# EAGLE design version10_31 (EAGLE 7.1.0)
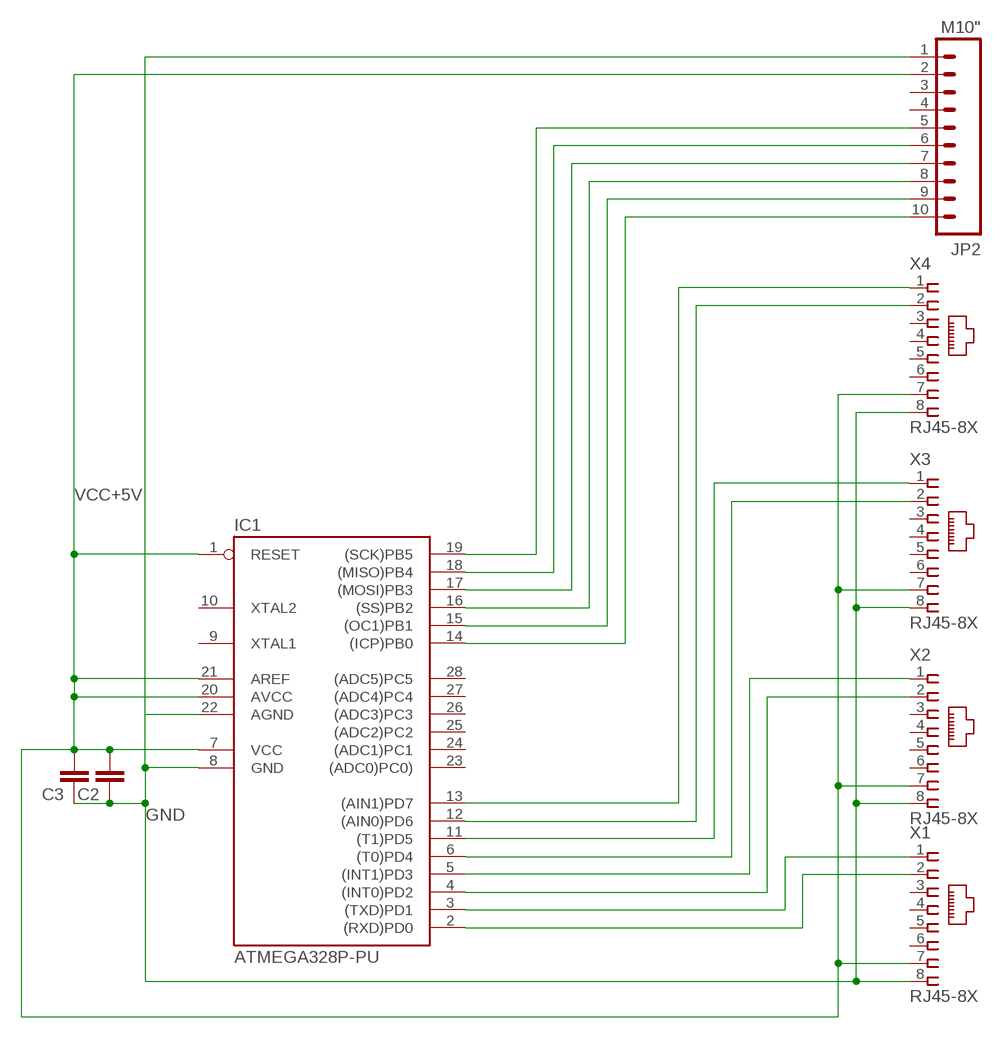
[diagram p0: schematic, sheet 1]

## Parts
C2  CAP1206  [1206]
C3  CAP1206  [1206]
IC1  ATMEGA328P-PU  [DIL28-3]
JP2  M10"  [1X10]
X1  RJ45-8X  [RJ45-NO-SHIELD]
X2  RJ45-8X  [RJ45-NO-SHIELD]
X3  RJ45-8X  [RJ45-NO-SHIELD]
X4  RJ45-8X  [RJ45-NO-SHIELD]

## Nets
GND: C2.1 C3.1 IC1.8(GND) IC1.22(AGND) JP2.1 X1.8 X2.8 X3.8 X4.8
N$1: IC1.19((SCK)PB5) JP2.5
N$2: IC1.18((MISO)PB4) JP2.6
N$3: IC1.15((OC1)PB1) JP2.9
N$4: IC1.17((MOSI)PB3) JP2.7
N$5: IC1.16((SS)PB2) JP2.8
N$6: IC1.14((ICP)PB0) JP2.10
N$7: IC1.2((RXD)PD0) X1.2
N$8: IC1.3((TXD)PD1) X1.1
N$9: IC1.4((INT0)PD2) X2.2
N$10: IC1.5((INT1)PD3) X2.1
N$11: IC1.6((T0)PD4) X3.2
N$12: IC1.11((T1)PD5) X3.1
N$13: IC1.12((AIN0)PD6) X4.2
N$14: IC1.13((AIN1)PD7) X4.1
VCC+5V: C2.2 C3.2 IC1.1(RESET) IC1.7(VCC) IC1.20(AVCC) IC1.21(AREF) JP2.2 X1.7 X2.7 X3.7 X4.7
Unconnected: IC1.9(XTAL1) IC1.10(XTAL2) IC1.23((ADC0)PC0)) IC1.24((ADC1)PC1) IC1.25((ADC2)PC2) IC1.26((ADC3)PC3) IC1.27((ADC4)PC4) IC1.28((ADC5)PC5) JP2.3 JP2.4 X1.3 X1.4 X1.5 X1.6 X2.3 X2.4 X2.5 X2.6 X3.3 X3.4 X3.5 X3.6 X4.3 X4.4 X4.5 X4.6

## Library data of the parts
C2 C3 = SparkFun-Capacitors:CAP: Capacitor Standard 0603 ceramic capacitor, and 0.1" leaded capacitor.
IC1 = SmartPrj:ATMEGA328P-: MICROCONTROLLER 4 Kbytes FLASH 128 bytes SRAM 256 bytes EEPROM UART 6-channel 10 bit ADC
JP2 = SparkFun-Connectors:M10: Header 10 Standard 10-pin 0.1" header. Use with straight break away headers (SKU : PRT-00116), right angle break away headers (PRT-00553), swiss pins (PRT-00743), machine pins (PRT-00117), and female headers (PRT-00115).
X1-X4 = con-tycoelectronics:RJ45: CORCOM Modular RJ Jacks No Shield Source: www.tycoelectronics.com .. ENG_DS_1654001_1099_RJ_L_0507.pdf; MPN: RJ45-8X; OC_FARNELL: unknown; OC_NEWARK: 16R6101

## Board
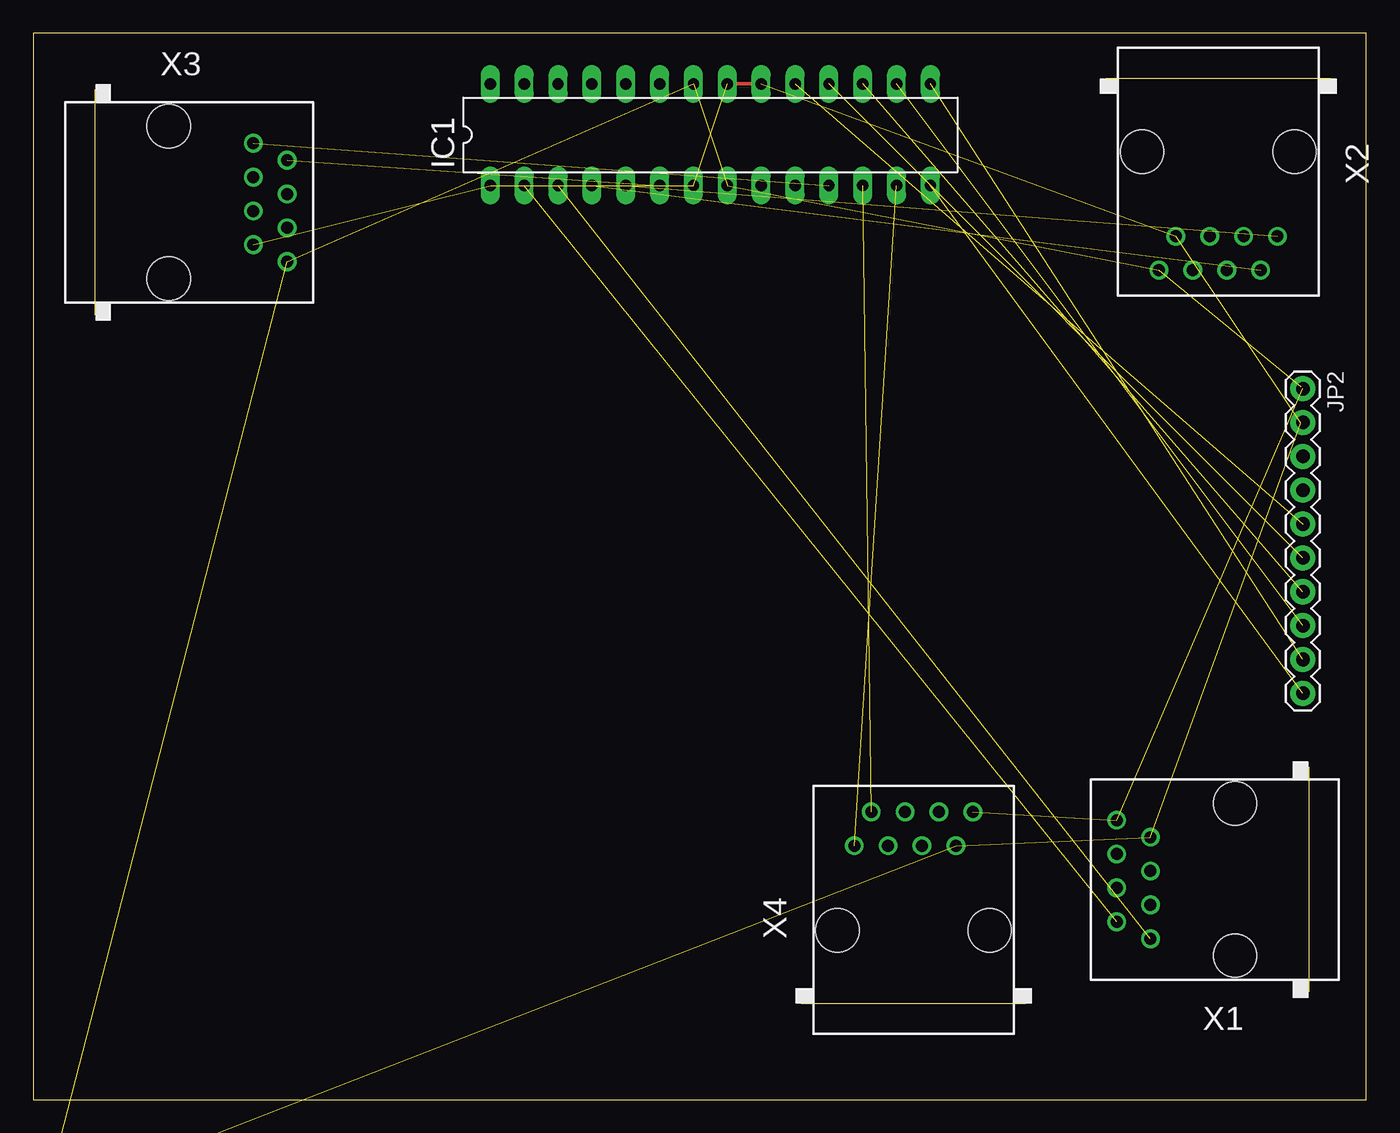
[diagram p1: board, top side]

Size 100 x 80 mm. Coordinates in mm from the lower left corner, seen from the top.
Outline: 0,0 100,0 100,80 0,80 0,0
Copper layers (1*16): Top 0.035mm / dielectric 1.5mm / Bottom 0.035mm
Design rules "default": minimum track width 10mil, minimum drill 24mil, track to track 8mil, track to pad 8mil, pad to pad 8mil, via to via 8mil, smd to smd 8mil, copper to edge 40mil, drill to drill 8mil, minimum pad ring 10mil, minimum via ring 8mil, stop-mask expansion 4mil, vias tented up to drill 0mil, thermal gap 10mil

### Footprints (pad centres in the part's own frame; a part is rotated, then mirrored left to right if it is on the bottom)
1206 = smd 1.6 x 1.8: 1 -1.4,0; 2 1.4,0
DIL28-3 = drill 0.85 pad 1.422 long: 1 -16.51,-3.81; 2 -13.97,-3.81; 3 -11.43,-3.81; 4 -8.89,-3.81; 5 -6.35,-3.81; 6 -3.81,-3.81; 7 -1.27,-3.81; 8 1.27,-3.81; 9 3.81,-3.81; 10 6.35,-3.81; 11 8.89,-3.81; 12 11.43,-3.81; 13 13.97,-3.81; 14 16.51,-3.81; 15 16.51,3.81; 16 13.97,3.81; 17 11.43,3.81; 18 8.89,3.81; 19 6.35,3.81; 20 3.81,3.81; 21 1.27,3.81; 22 -1.27,3.81; 23 -3.81,3.81; 24 -6.35,3.81; 25 -8.89,3.81; 26 -11.43,3.81; 27 -13.97,3.81; 28 -16.51,3.81
1X10 = drill 1.016 pad 1.88: 1 0,0; 2 2.54,0; 3 5.08,0; 4 7.62,0; 5 10.16,0; 6 12.7,0; 7 15.24,0; 8 17.78,0; 9 20.32,0; 10 22.86,0
RJ45-NO-SHIELD = drill 0.9 pad 1.4: 1 -4.445,6.35; 2 -3.175,8.89; 3 -1.905,6.35; 4 -0.635,8.89; 5 0.635,6.35; 6 1.905,8.89; 7 3.175,6.35; 8 4.445,8.89 | hole 3.251: -5.715,0; 5.715,0

### Placement (x,y rotation side)
C2  2.54,-6.35 0 top  (outside the outline)
C3  2.54,-10.16 0 top  (outside the outline)
IC1  50.8,72.39 0 top
JP2  95.25,53.34 270 top
X1  90.17,16.51 90 top
X2  88.9,71.12 180 top
X3  10.16,67.31 270 top
X4  66.04,12.7 0 top

### Tracks (layer width: path | path; a pad name or v marks a point on that pad's centre or on a via)
GND  (8 unrouted)
  Top 0.254: 95.1,53.49 JP2.1
N$1  (1 unrouted)
N$2  (1 unrouted)
N$3  (1 unrouted)
N$4  (1 unrouted)
N$5  (1 unrouted)
N$6  (1 unrouted)
N$7  (1 unrouted)
N$8  (1 unrouted)
N$9  (1 unrouted)
N$10  (1 unrouted)
N$11  (1 unrouted)
N$12  (1 unrouted)
N$13  (1 unrouted)
N$14  (1 unrouted)
VCC+5V  (9 unrouted)
  Top 0.254: IC1.20 IC1.21 | 95.1,50.75 JP2.2